# EAGLE design sensebox (EAGLE 6.1)
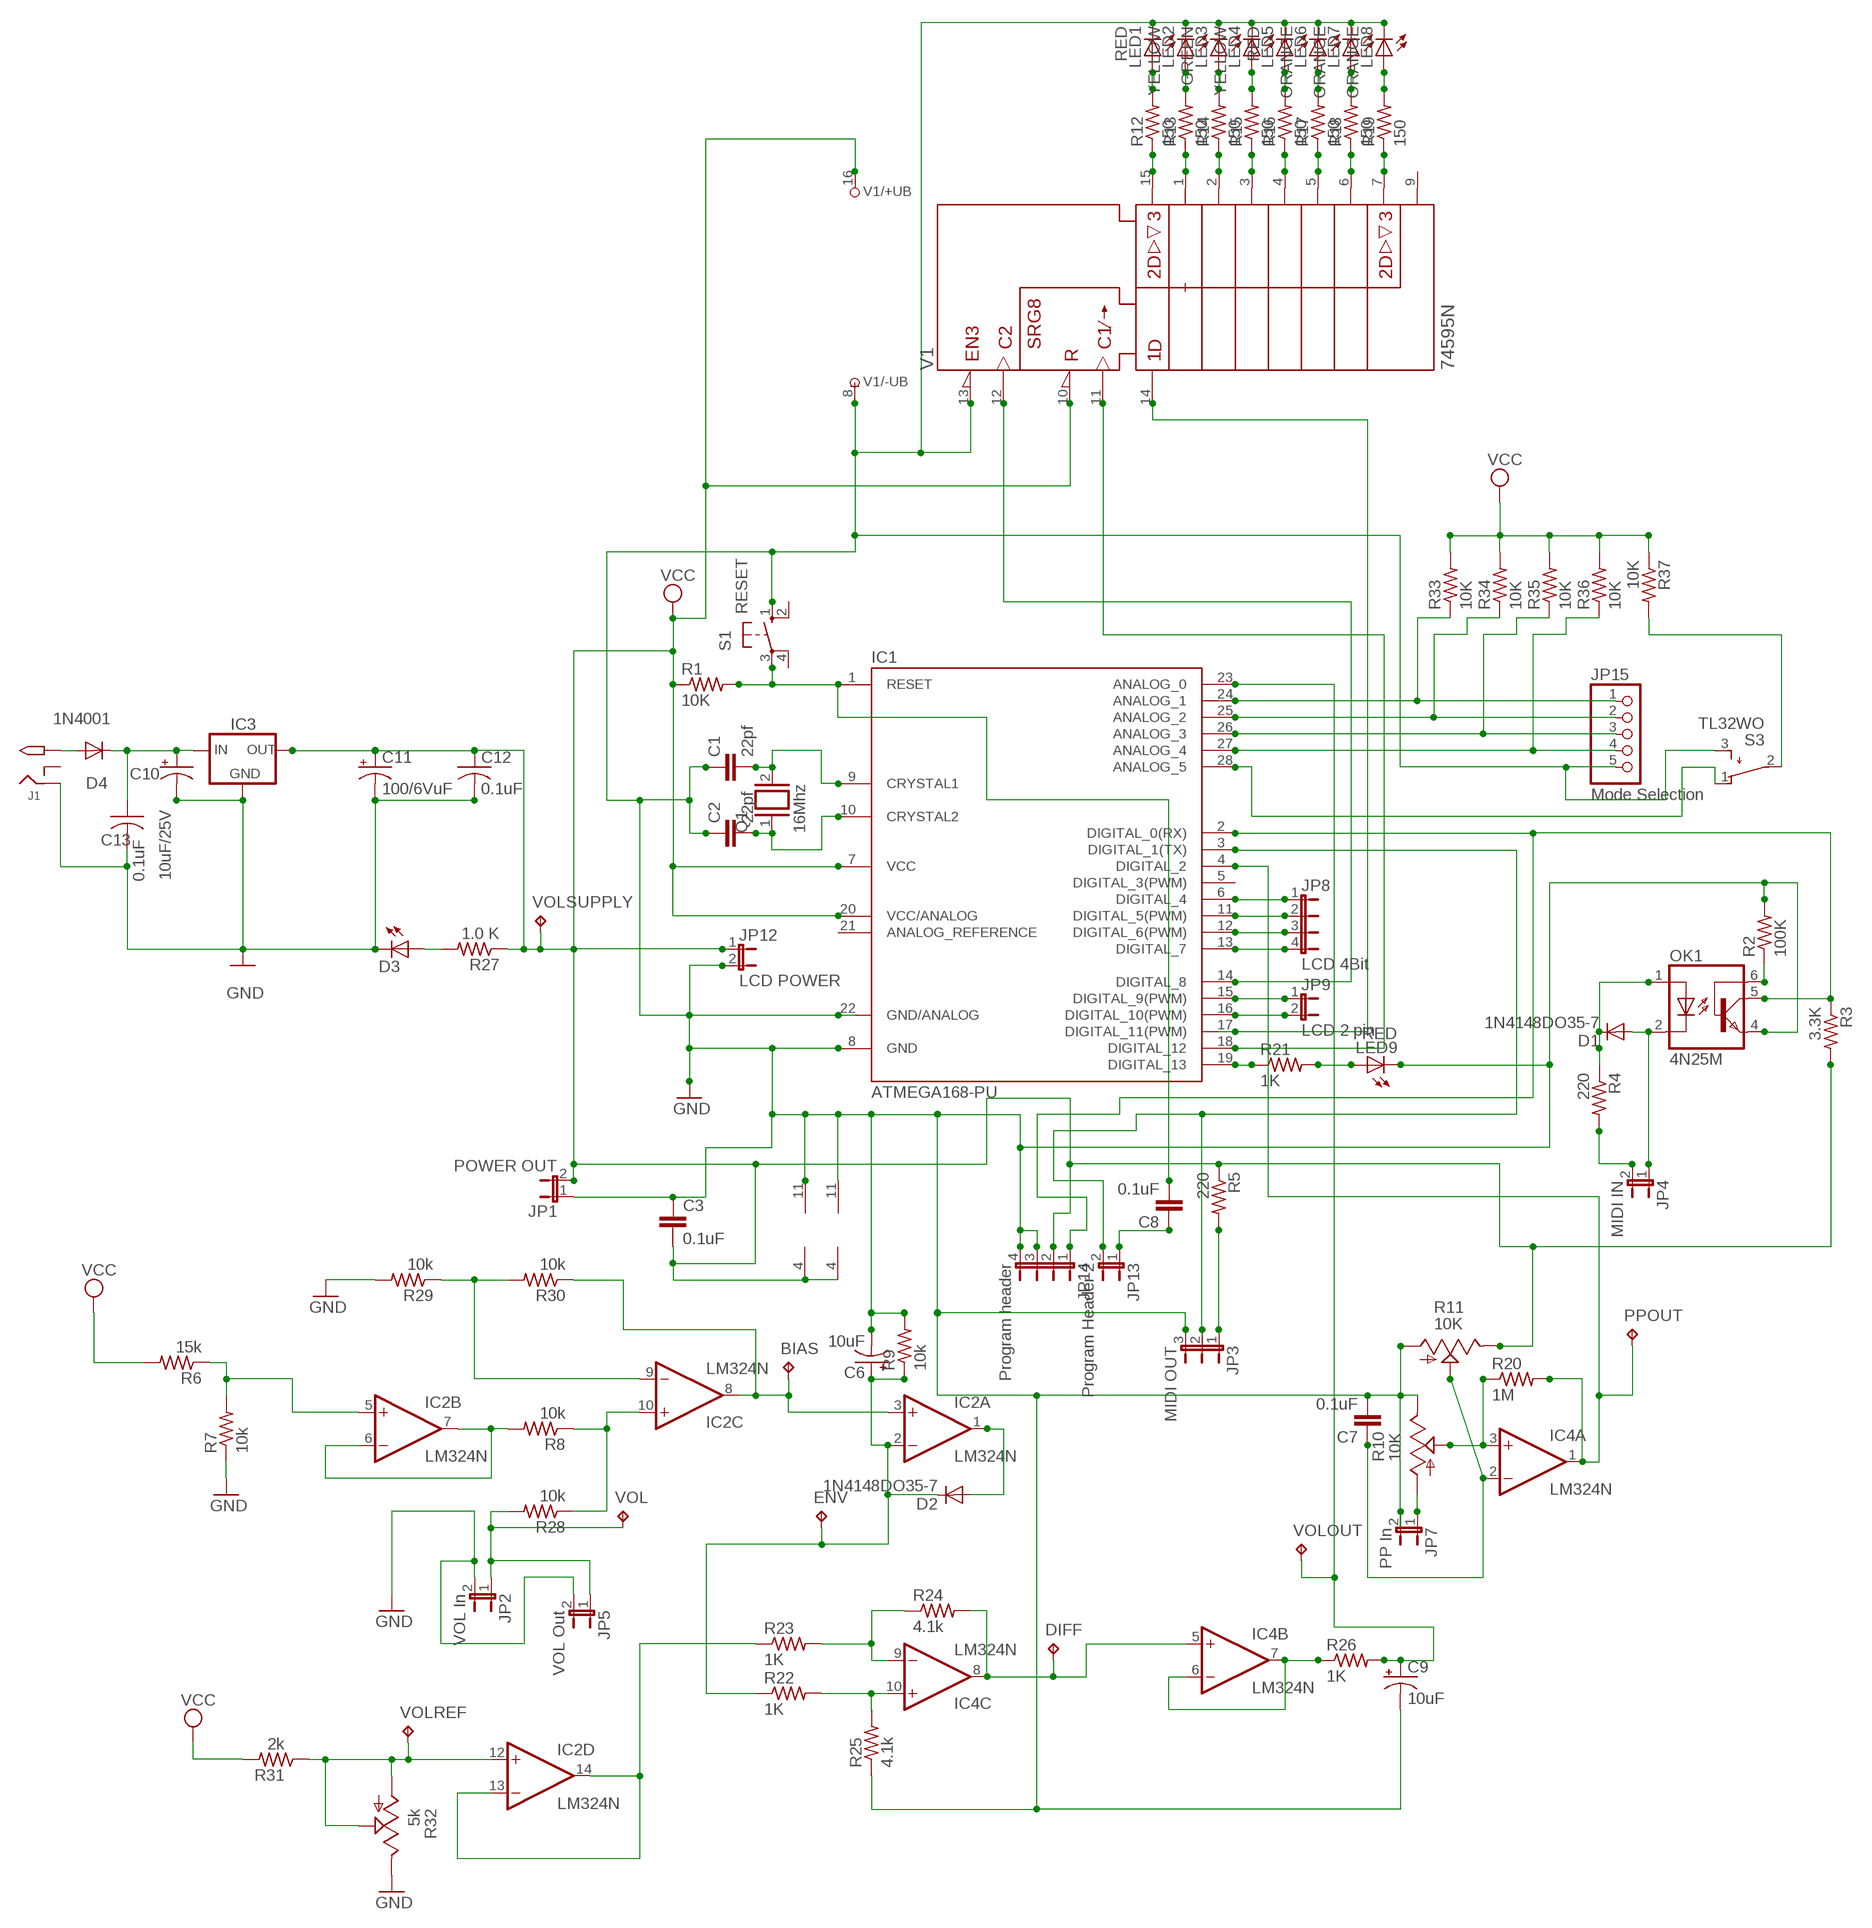
[diagram p0: schematic, sheet 1]

## Parts
BIAS  TP1X1  [TP1X1]
C1  22pf  C2.5/2  [C2.5-2]
C2  22pf  C2.5/2  [C2.5-2]
C3  0.1uF  C5/2.5  [C5B2.5]
C6  10uF  CPOL-USE5-8.5  [E5-8,5]
C7  0.1uF  C5/2.5  [C5B2.5]
C8  0.1uF  C2.5/2  [C2.5-2]
C9  10uF  CPOL-USE5-8.5  [E5-8,5]
C10  10uF/25V  CPOL-USE2.5-6  [E2,5-6]
C11  100/6VuF  CPOL-USE2.5-6  [E2,5-6]
C12  0.1uF  C-US025-025X050  [C025-025X050]
C13  0.1uF  C-US025-025X050  [C025-025X050]
D1  1N4148DO35-7  [DO35-7]
D2  1N4148DO35-7  [DO35-7]
D3  GREEN  LED3MM  [LED3MM]
D4  1N4001  1N4004  [DO41-10]
DIFF  TP1X1  [TP1X1]
ENV  TP1X1  [TP1X1]
IC1  ATMEGA168-PU  [DIL28-3]
IC2  LM324N  [DIL14]
IC3  +5v 7805  78XXS  [78XXS]
IC4  LM324N  [DIL14]
J1  2.1MMJACK  [PJ-102A]
JP1  POWER OUT  JP1E  [JP1]
JP2  VOL In  JP1E  [JP1]
JP3  MIDI OUT  JP2E  [JP2]
JP4  MIDI IN  JP1E  [JP1]
JP5  VOL Out  JP1E  [JP1]
JP7  PP In  JP1E  [JP1]
JP8  LCD 4Bit  JP4E  [JP4]
JP9  LCD 2 pin  JP1E  [JP1]
JP12  LCD POWER  JP1E  [JP1]
JP13  Program Header 2  JP1E  [JP1]
JP14  Program header  JP4E  [JP4]
JP15  Mode Selection  PINHD-1X5  [1X05]
LED1  RED  LED5MM  [LED5MM]
LED2  YELLOW  LED5MM  [LED5MM]
LED3  GREEN  LED5MM  [LED5MM]
LED4  YELLOW  LED5MM  [LED5MM]
LED5  RED  LED5MM  [LED5MM]
LED6  ORANGE  LED5MM  [LED5MM]
LED7  ORANGE  LED5MM  [LED5MM]
LED8  ORANGE  LED5MM  [LED5MM]
LED9  RED  LED5MM  [LED5MM]
OK1  4N25M  [DIL06]
PPOUT  TP1X1  [TP1X1]
Q1  16Mhz  XTAL  [Q]
R1  10K  R-US_0207/7  [0207/7]
R2  100K  R-US_0207/7  [0207/7]
R3  3.3K  R-US_0207/7  [0207/7]
R4  220  R-US_0207/7  [0207/7]
R5  220  R-US_0207/7  [0207/7]
R6  15k  R-US_0207/10  [0207/10]
R7  10k  R-US_0207/10  [0207/10]
R8  10k  R-US_0207/10  [0207/10]
R9  10k  R-US_0207/7  [0207/7]
R10  10K  TRIM_US-B64Y  [B64Y]
R11  10K  TRIM_US-B64Y  [B64Y]
R12  150  R-US_0207/7  [0207/7]
R13  150  R-US_0207/7  [0207/7]
R14  150  R-US_0207/7  [0207/7]
R15  150  R-US_0207/7  [0207/7]
R16  150  R-US_0207/7  [0207/7]
R17  150  R-US_0207/7  [0207/7]
R18  150  R-US_0207/7  [0207/7]
R19  150  R-US_0207/7  [0207/7]
R20  1M  R-US_0207/7  [0207/7]
R21  1K  R-US_0207/7  [0207/7]
R22  1K  R-US_0207/7  [0207/7]
R23  1K  R-US_0207/7  [0207/7]
R24  4.1k  R-US_0207/7  [0207/7]
R25  4.1k  R-US_0207/7  [0207/7]
R26  1K  R-US_0207/7  [0207/7]
R27  1.0 K  R-US_0207/5V  [0207/5V]
R28  10k  R-US_0207/10  [0207/10]
R29  10k  R-US_0207/10  [0207/10]
R30  10k  R-US_0207/10  [0207/10]
R31  2k  R-US_0207/10  [0207/10]
R32  5k  TRIM_US-B64Y  [B64Y]
R33  10K  R-US_0207/7  [0207/7]
R34  10K  R-US_0207/7  [0207/7]
R35  10K  R-US_0207/7  [0207/7]
R36  10K  R-US_0207/7  [0207/7]
R37  10K  R-US_0207/7  [0207/7]
S1  RESET  10-XX  [B3F-10XX]
S3  TL32WO  [TL3XWO]
V1  74595N  [DIL16]
VOL  TP1X1  [TP1X1]
VOLOUT  TP1X1  [TP1X1]
VOLREF  TP1X1  [TP1X1]
VOLSUPPLY  TP1X1  [TP1X1]

## Nets
GND: C1.1 C2.1 C3.1 C6.- C7.2 C9.- C10.- C11.- C12.2 C13.2 D3.K(C) IC1.8(GND) IC1.22(GND/ANALOG) IC2.11(P:V-) IC3.GND IC4.11(P:V-) J1.RING JP1.1 JP2.2 JP3.3 JP5.2 JP7.2 JP12.2 JP14.3 JP14.4 JP15.5 LED1.K(C) LED2.K(C) LED3.K(C) LED4.K(C) LED5.K(C) LED6.K(C) LED7.K(C) LED8.K(C) LED9.K(C) OK1.4(EMI) R2.2 R7.1 R9.2 R10.E R11.A R25.1 R29.2 R32.E S1.1(S) S3.3(S) V1.8(-UB) V1.13(!G)
N$1: C8.2 IC1.1(RESET) R1.2 S1.3(P)
N$2: C1.2 IC1.9(CRYSTAL1) Q1.2
N$3: C2.2 IC1.10(CRYSTAL2) Q1.1
N$4: JP3.1 R5.2
N$5: IC1.3(DIGITAL_1(TX)) JP3.2 JP13.2
N$6: D1.A JP4.1 OK1.2(C)
N$7: D4.A J1.TIP
N$8: OK1.6(BAS) R2.1
N$9: IC2.5(B:+IN) R6.1 R7.2
N$10: IC1.2(DIGITAL_0(RX)) JP14.1 OK1.5(COL) R3.1
N$11: JP2.1 JP5.1 R28.2 VOL.P$1(TP)
N$12: JP7.1 R10.A
N$13: JP4.2 R4.2
N$14: D2.A IC2.1(A:OUT)
N$15: C6.+ D2.C ENV.P$1(TP) IC2.2(A:-IN) R9.1 R22.1
N$16: IC2.10(C:+IN) R8.1 R28.1
N$17: IC4.3(A:+IN) R10.S R20.1
N$18: C7.1 IC4.2(A:-IN) R11.S
N$19: R12.1 V1.15(QA)
N$20: IC1.4(DIGITAL_2) IC4.1(A:OUT) PPOUT.P$1(TP) R20.2
N$21: IC1.17(DIGITAL_11(PWM)) V1.14(SER)
N$22: IC1.18(DIGITAL_12) V1.11(SRCK)
N$23: IC1.14(DIGITAL_8) V1.12(RCK)
N$24: R13.1 V1.1(QB)
N$25: R14.1 V1.2(QC)
N$26: R15.1 V1.3(QD)
N$27: R16.1 V1.4(QE)
N$28: R17.1 V1.5(QF)
N$29: R18.1 V1.6(QG)
N$30: R19.1 V1.7(QH)
N$31: LED1.A R12.2
N$32: LED2.A R13.2
N$33: LED3.A R14.2
N$34: LED4.A R15.2
N$35: LED5.A R16.2
N$36: LED6.A R17.2
N$37: LED7.A R18.2
N$38: LED8.A R19.2
N$39: IC1.24(ANALOG_1) JP15.1 R33.1
N$40: IC1.6(DIGITAL_4) JP8.1
N$41: IC1.11(DIGITAL_5(PWM)) JP8.2
N$42: IC1.12(DIGITAL_6(PWM)) JP8.3
N$43: IC1.13(DIGITAL_7) JP8.4
N$44: IC1.15(DIGITAL_9(PWM)) JP9.1
N$45: IC1.16(DIGITAL_10(PWM)) JP9.2
N$46: IC1.28(ANALOG_5) S3.1(O)
N$47: IC1.25(ANALOG_2) JP15.2 R34.1
N$48: C8.1 JP13.1
N$49: IC1.19(DIGITAL_13) R21.1
N$50: LED9.A R21.2
N$51: IC4.6(B:-IN) IC4.7(B:OUT) R26.1
N$52: IC4.9(C:-IN) R23.2 R24.1
N$53: IC4.10(C:+IN) R22.2 R25.2
N$54: DIFF.P$1(TP) IC4.5(B:+IN) IC4.8(C:OUT) R24.2
N$55: D1.C OK1.1(A) R4.1
N$56: C9.+ IC1.23(ANALOG_0) R26.2 VOLOUT.P$1(TP)
N$57: C10.+ C13.1 D4.C IC3.IN
N$58: D3.A R27.2
N$59: IC2.6(B:-IN) IC2.7(B:OUT) R8.2
N$60: IC1.26(ANALOG_3) JP15.3 R35.1
N$61: IC1.27(ANALOG_4) JP15.4 R36.1
N$62: R37.2 S3.2(P)
N$63: IC2.13(D:-IN) IC2.14(D:OUT) R23.1
N$66: IC2.9(C:-IN) R29.1 R30.2
N$68: BIAS.P$1(TP) IC2.3(A:+IN) IC2.8(C:OUT) R30.1
N$71: IC2.12(D:+IN) R31.1 R32.A R32.S VOLREF.P$1(TP)
VCC: C3.2 C11.+ C12.1 IC1.7(VCC) IC1.20(VCC/ANALOG) IC2.4(P:V+) IC3.OUT IC4.4(P:V+) JP1.2 JP12.1 JP14.2 R1.1 R3.2 R5.1 R6.2 R11.E R27.1 R31.2 R33.2 R34.2 R35.2 R36.2 R37.1 V1.10(!SRCLR) V1.16(+UB) VOLSUPPLY.P$1(TP)
Unconnected: IC1.5(DIGITAL_3(PWM)) IC1.21(ANALOG_REFERENCE) IC4.12(D:+IN) IC4.13(D:-IN) IC4.14(D:OUT) J1.RING_SW S1.2(S1) S1.4(P1) V1.9(QH*)

## Library data of the parts
BIAS DIFF ENV PPOUT VOL VOLOUT VOLREF VOLSUPPLY = testpad (2):TP1X1
C1-C3 C7 C8 = capacitor-wima:C: CAPACITOR naming: grid - package width
C6 C9 = rcl:CPOL-US: POLARIZED CAPACITOR, American symbol
C10 C11 = minimidi:CPOL-US: POLARIZED CAPACITOR, American symbol
C12 C13 = minimidi:C-US: CAPACITOR, American symbol
D1 D2 = diode:1N4148: DIODE high speed (Philips)
D3 = minimidi:LED: LED
D4 = minimidi:1N4004: DIODE general purpose rectifier, 1 A
IC1 = Arduino-AVR:ATMEGA168-PU
IC2 IC4 = linear:LM324: OP AMP
IC3 = v-reg:78XXS: VOLTAGE REGULATOR
J1 = minimidi:2.1MMJACK
JP1 JP2 JP4 JP5 JP7 JP9 JP12 JP13 = jumper:JP1E: JUMPER
JP3 = jumper:JP2E: JUMPER
JP8 JP14 = jumper:JP4E: JUMPER
JP15 = pinhead:PINHD-1X5: PIN HEADER
LED1-LED9 = led:LED: LED
OK1 = optocoupler:4N*?M: General Purpose 6-Pin Phototransistor Optocouplers Source: http://www.fairchildsemi.com/ds/4N/4N35-M.pdf
Q1 = special:XTAL: CRYSTAL
R1-R5 R9 R12-R26 R28 R30 R33-R37 = resistor:R-US_: RESISTOR, American symbol
R6-R8 R29 R31 = rcl:R-US_: RESISTOR, American symbol
R10 R11 R32 = pot:TRIM_US-: POTENTIOMETER
R27 = minimidi:R-US_: RESISTOR, American symbol
S1 = switch-omron:10-XX: OMRON SWITCH
S3 = switch:TL32WO: TINY SWITCH ON - MOM Source: http://www2.produktinfo.conrad.com/datenblaetter/700000-724999/705152-da-01-de-Subminiaturschalter_TL_36WO.pdf
V1 = 74ttl-din:74*595: 8-bit SHIFT REGISTER, output latch

## Board
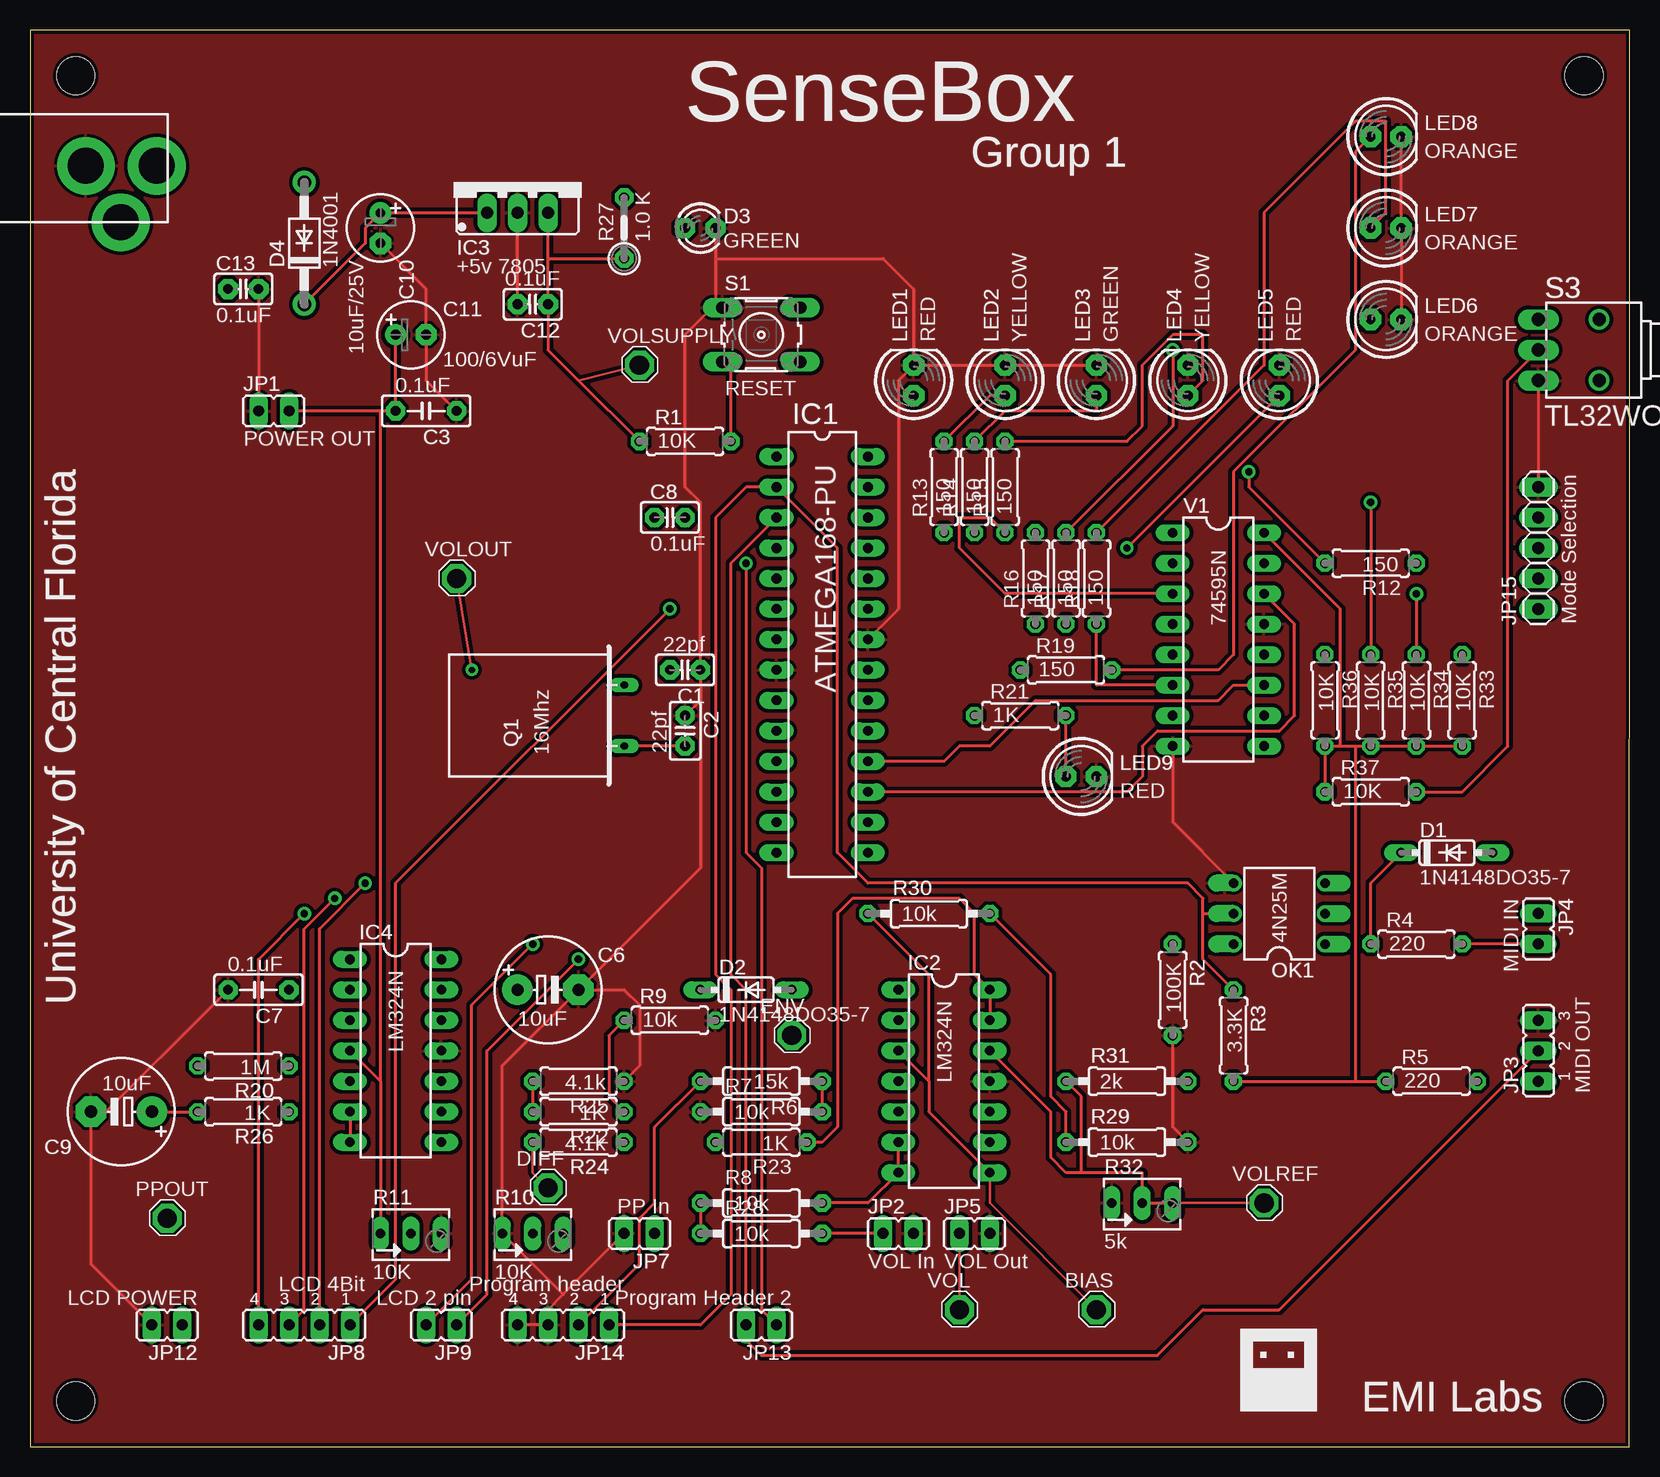
[diagram p1: board, top side]
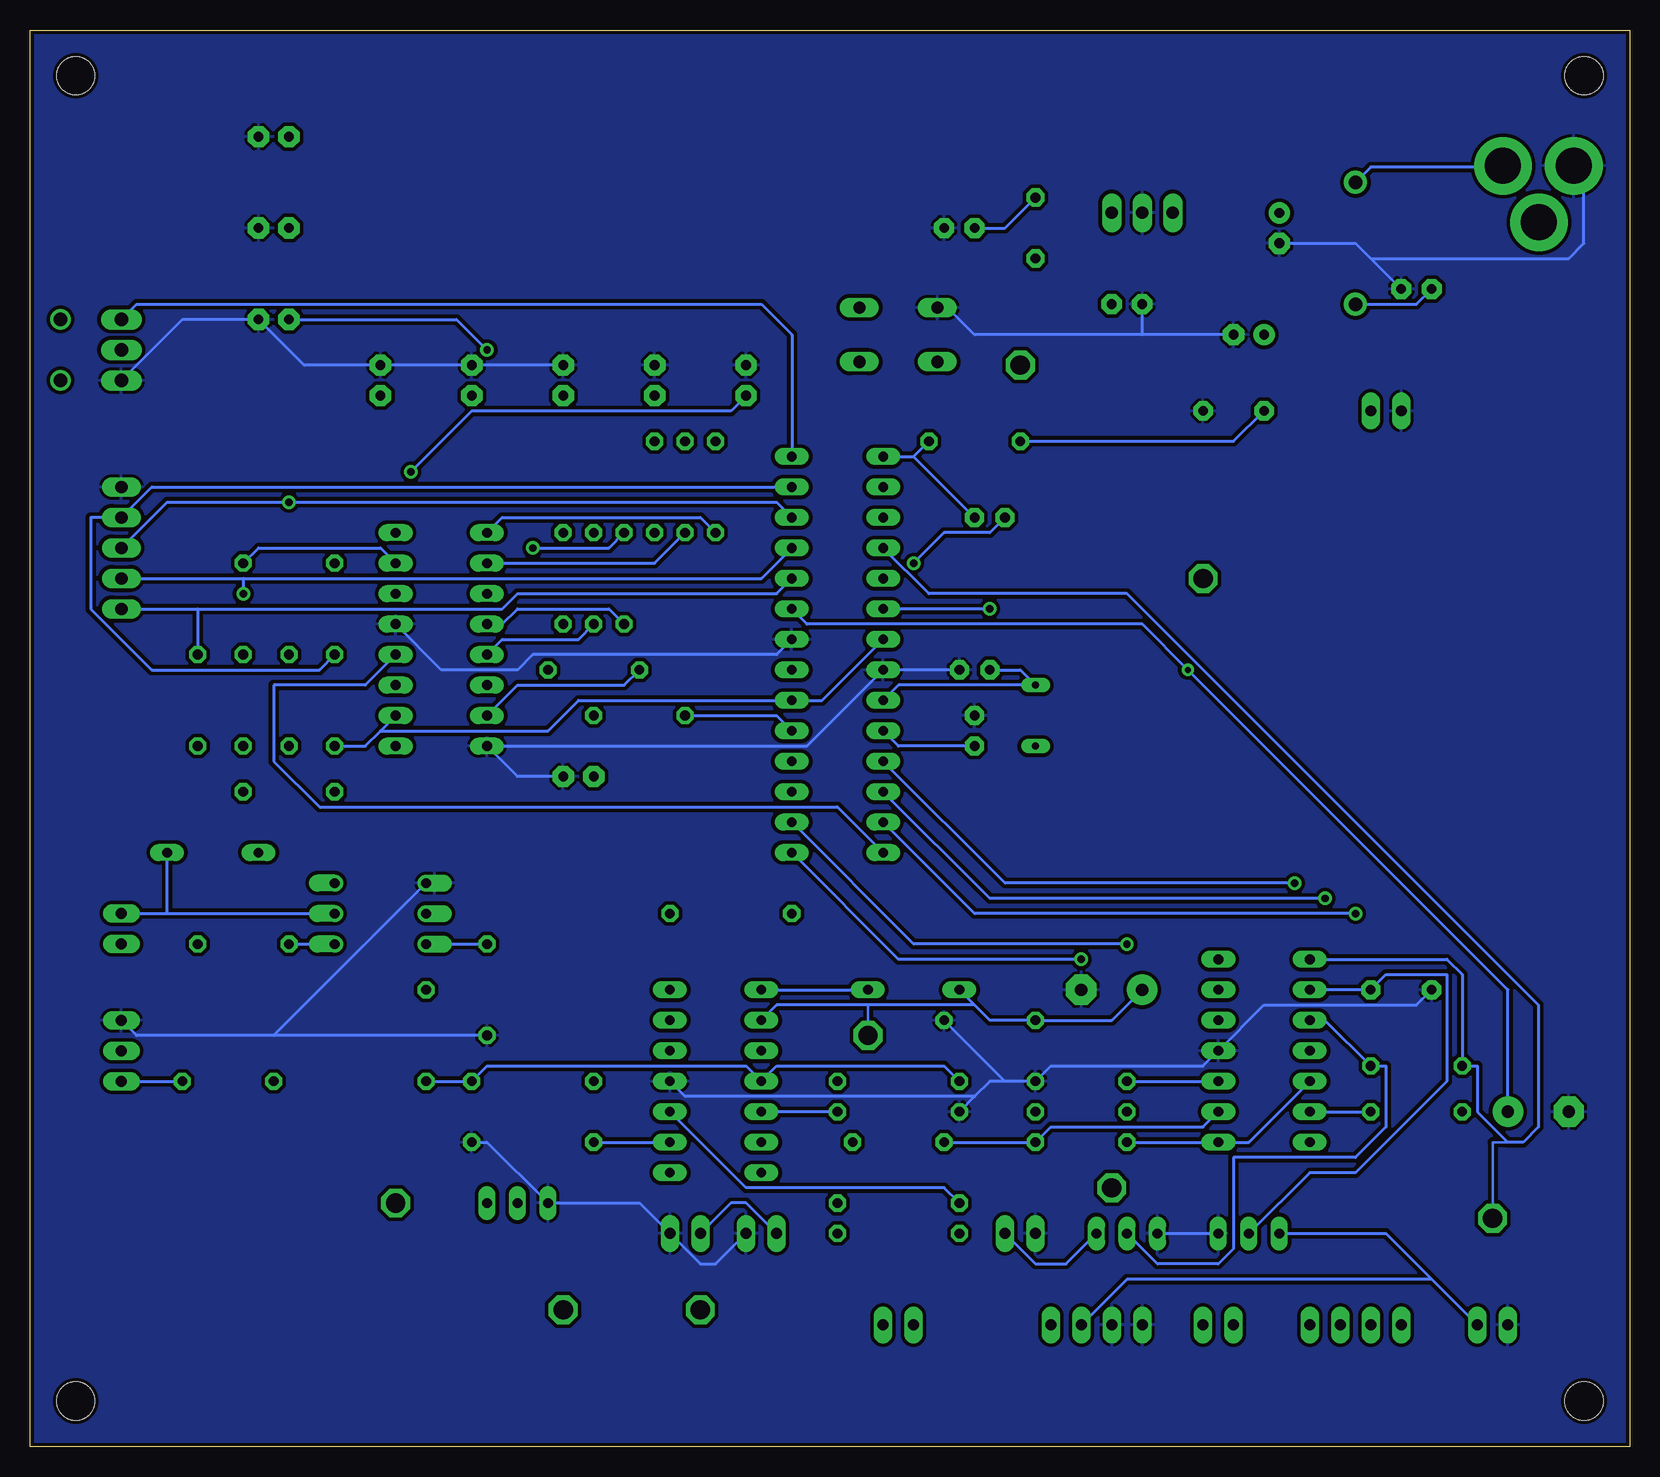
[diagram p2: board, bottom side, seen from below]

Size 133.35 x 118.11 mm. Coordinates in mm from the lower left corner, seen from the top.
Outline: 0,0 133.33,0 133.35,118.11 0,118.11 0,0
Copper layers (1*16): Top 0.035mm / dielectric 1.5mm / Bottom 0.035mm
Design rules: minimum track width 8mil, minimum drill 20mil, track to track 8mil, track to pad 8mil, pad to pad 8mil, via to via 8mil, smd to smd 8mil, copper to edge 10mil, drill to drill 8mil, minimum pad ring 12mil, minimum via ring 10mil, stop-mask expansion 4mil, vias tented up to drill 25mil, thermal gap 10mil
Holes 3.17 mm at 3.81,114.3 129.54,114.3 129.54,3.81 3.81,3.81

### Footprints (pad centres in the part's own frame; a part is rotated, then mirrored left to right if it is on the bottom)
TP1X1 = drill 1.6 octagon: P$1 0,0
C2.5-2 = drill 0.813 pad 1.6 octagon: 1 -1.27,0; 2 1.27,0
C5B2.5 = drill 0.813 pad 1.6 octagon: 1 -2.54,0; 2 2.54,0
E5-8,5 = drill 1.016 pad 2.54: + -2.54,0 | drill 1.016 pad 2.54 octagon: - 2.54,0
E2,5-6 = drill 0.813 pad 1.778: + -1.27,0 | drill 0.813 pad 1.778 octagon: - 1.27,0
C025-025X050 = drill 0.813 pad 1.676 octagon: 1 -1.27,0; 2 1.27,0
DO35-7 = drill 0.813 long: A 3.81,0; C -3.81,0
LED3MM = drill 0.813 pad 1.676 octagon: A -1.27,0; K 1.27,0
DO41-10 = drill 1.118 pad 1.93: A 5.08,0; C -5.08,0
DIL28-3 = drill 0.813 long: 1 -16.51,-3.81; 2 -13.97,-3.81; 3 -11.43,-3.81; 4 -8.89,-3.81; 5 -6.35,-3.81; 6 -3.81,-3.81; 7 -1.27,-3.81; 8 1.27,-3.81; 9 3.81,-3.81; 10 6.35,-3.81; 11 8.89,-3.81; 12 11.43,-3.81; 13 13.97,-3.81; 14 16.51,-3.81; 15 16.51,3.81; 16 13.97,3.81; 17 11.43,3.81; 18 8.89,3.81; 19 6.35,3.81; 20 3.81,3.81; 21 1.27,3.81; 22 -1.27,3.81; 23 -3.81,3.81; 24 -6.35,3.81; 25 -8.89,3.81; 26 -11.43,3.81; 27 -13.97,3.81; 28 -16.51,3.81
DIL14 = drill 0.813 long: 1 -7.62,-3.81; 2 -5.08,-3.81; 3 -2.54,-3.81; 4 0,-3.81; 5 2.54,-3.81; 6 5.08,-3.81; 7 7.62,-3.81; 8 7.62,3.81; 9 5.08,3.81; 10 2.54,3.81; 11 0,3.81; 12 -2.54,3.81; 13 -5.08,3.81; 14 -7.62,3.81
78XXS = drill 1.016 long: GND 0,-2.54; IN -2.54,-2.54; OUT 2.54,-2.54
PJ-102A = drill 3 pad 4.8: RING 0.1,-3.39; RING_SW -4.6,-6.29; TIP 0.1,-9.29
JP1 = drill 0.914 long: 1 0,-1.27; 2 0,1.27
JP2 = drill 0.914 long: 1 -2.54,0; 2 0,0; 3 2.54,0
JP4 = drill 0.914 long: 1 -3.81,0; 2 -1.27,0; 3 1.27,0; 4 3.81,0
1X05 = drill 1.016 long: 1 -5.08,0; 2 -2.54,0; 3 0,0; 4 2.54,0; 5 5.08,0
LED5MM = drill 0.813 pad 1.778 octagon: A -1.27,0; K 1.27,0
DIL06 = drill 0.813 offset: 1 -2.54,-3.81; 2 0,-3.81; 3 2.54,-3.81; 4 2.54,3.81; 5 0,3.81; 6 -2.54,3.81
Q = drill 0.61 long: 1 -2.54,-7.62; 2 2.54,-7.62
0207/7 = drill 0.813 octagon: 1 -3.81,0; 2 3.81,0
0207/10 = drill 0.813 octagon: 1 -5.08,0; 2 5.08,0
B64Y = drill 0.813 long: A 2.54,0; E -2.54,0; S 0,0
0207/5V = drill 0.813 pad 1.524 octagon: 1 -2.54,0; 2 2.54,0
B3F-10XX = drill 1.016 long: 1 -3.251,2.261; 2 3.251,2.261; 3 -3.251,-2.261; 4 3.251,-2.261
TL3XWO = drill 1.1 pad 1.422 long: 1 -2.54,-5.08; 2 0,-5.08; 3 2.54,-5.08 | drill 1.1 pad 1.676: M1 -2.54,0; M2 2.54,0
DIL16 = drill 0.813 long: 1 -8.89,-3.81; 2 -6.35,-3.81; 3 -3.81,-3.81; 4 -1.27,-3.81; 5 1.27,-3.81; 6 3.81,-3.81; 7 6.35,-3.81; 8 8.89,-3.81; 9 8.89,3.81; 10 6.35,3.81; 11 3.81,3.81; 12 1.27,3.81; 13 -1.27,3.81; 14 -3.81,3.81; 15 -6.35,3.81; 16 -8.89,3.81

### Placement (x,y rotation side)
BIAS  88.9,11.43 0 top
C1  54.61,64.77 180 top
C2  54.61,59.69 270 top
C3  33.02,86.36 180 top
C6  43.18,38.1 0 top
C7  19.05,38.1 180 top
C8  53.34,77.47 0 top
C9  7.62,27.94 180 top
C10  29.21,101.6 270 top
C11  31.75,92.71 0 top
C12  41.91,95.25 180 top
C13  17.78,96.52 0 top
D1  118.11,49.53 0 top
D2  59.69,38.1 0 top
D3  55.88,101.6 0 top
D4  22.86,100.33 90 top
DIFF  43.18,21.59 0 top
ENV  63.5,34.29 0 top
IC1  66.04,66.04 270 top
IC2  76.2,30.48 270 top
IC3  40.64,105.41 0 top
IC4  30.48,33.02 270 top
J1  1.27,106.68 90 top
JP1  20.32,86.36 270 top
JP2  72.39,17.78 270 top
JP3  125.73,33.02 90 top
JP4  125.73,43.18 180 top
JP5  78.74,17.78 270 top
JP7  50.8,17.78 90 top
JP8  22.86,10.16 180 top
JP9  34.29,10.16 90 top
JP12  11.43,10.16 90 top
JP13  60.96,10.16 90 top
JP14  44.45,10.16 180 top
JP15  125.73,74.93 90 top
LED1  73.66,88.9 90 top
LED2  81.28,88.9 90 top
LED3  88.9,88.9 90 top
LED4  96.52,88.9 90 top
LED5  104.14,88.9 90 top
LED6  113.03,93.98 0 top
LED7  113.03,101.6 0 top
LED8  113.03,109.22 0 top
LED9  87.63,55.88 0 top
OK1  104.14,44.45 90 top
PPOUT  11.43,19.05 0 top
Q1  41.91,60.96 90 top
R1  54.61,83.82 0 top
R2  95.25,38.1 270 top
R3  100.33,34.29 270 top
R4  115.57,41.91 0 top
R5  116.84,30.48 0 top
R6  60.96,30.48 180 top
R7  60.96,27.94 0 top
R8  60.96,20.32 0 top
R9  53.34,35.56 0 top
R10  41.91,17.78 0 top
R11  31.75,17.78 0 top
R12  111.76,73.66 180 top
R13  76.2,80.01 90 top
R14  78.74,80.01 90 top
R15  81.28,80.01 90 top
R16  83.82,72.39 90 top
R17  86.36,72.39 90 top
R18  88.9,72.39 90 top
R19  86.36,64.77 0 top
R20  17.78,31.75 180 top
R21  82.55,60.96 0 top
R22  45.72,27.94 180 top
R23  60.96,25.4 180 top
R24  45.72,25.4 180 top
R25  45.72,30.48 180 top
R26  17.78,27.94 180 top
R27  49.53,101.6 90 top
R28  60.96,17.78 0 top
R29  91.44,25.4 0 top
R30  74.93,44.45 0 top
R31  91.44,30.48 0 top
R32  92.71,20.32 0 top
R33  119.38,62.23 270 top
R34  115.57,62.23 270 top
R35  111.76,62.23 270 top
R36  107.95,62.23 270 top
R37  111.76,54.61 0 top
S1  60.96,92.71 0 top
S3  130.81,91.44 270 top
V1  99.06,67.31 270 top
VOL  77.47,11.43 0 top
VOLOUT  35.56,72.39 0 top
VOLREF  102.87,20.32 0 top
VOLSUPPLY  50.8,90.17 0 top

### Tracks (layer width: path | path; a pad name or v marks a point on that pad's centre or on a via)
GND
  Top 0.254: C13.2 JP1.1 | C12.2 IC3.GND | D3.K 57.15,99.06 | 57.15,99.06 57.15,95.25 | C3.1 33.02,88.9 C11.- 33.02,96.52 C10.- | S3.3 JP15.5 | LED6.K LED7.K LED8.K | IC1.22 72.39,69.85 72.39,88.9 LED1.K | LED1.K LED2.K LED3.K | JP14.4 JP14.3 43.18,11.43 44.45,12.7 | 44.45,12.7 JP7.2 | 44.45,12.7 R10.E 39.37,31.75 C6.- | JP12.2 5.08,15.24 5.08,26.67 | C9.- 5.08,26.67 | 5.08,26.67 C7.2 | R25.1 50.8,31.75 50.8,36.83 49.53,38.1 C6.- | 55.88,62.23 C2.1 | 55.88,62.23 C1.1 55.88,78.74 54.61,80.01 54.61,92.71 57.15,95.25 | OK1.4 95.25,52.07 V1.8 | R2.2 95.25,26.67 R29.2 | C6.- 55.88,48.26 55.88,62.23 | 57.15,95.25 S1.1 | 57.15,99.06 71.12,99.06 73.66,96.52 LED1.K
  Bottom 0.254: C11.- 40.64,92.71 | 40.64,92.71 54.61,92.71 57.15,95.25 S1.1 | 40.64,92.71 C12.2 | 21.59,99.06 22.86,100.33 C10.- | 21.59,99.06 C13.2 | J1.RING 3.81,106.68 3.81,100.33 5.08,99.06 21.59,99.06 | S3.3 120.65,93.98 LED6.K 110.49,90.17 LED5.K LED4.K LED3.K | V1.13 99.06,64.77 92.71,64.77 91.44,66.04 71.12,66.04 IC1.22 | R10.E R11.A | 54.61,29.21 53.34,30.48 52.07,30.48 | 54.61,29.21 R7.1 | 52.07,30.48 R25.1 48.26,31.75 35.56,31.75 IC4.11 30.48,36.83 17.78,36.83 C7.2 | 52.07,30.48 R9.2 | IC2.11 78.74,29.21 54.61,29.21 | C1.1 IC1.8 68.58,58.42 V1.8 92.71,55.88 LED9.K | JP2.2 76.2,15.24 77.47,15.24 JP5.2 82.55,20.32 R32.E 95.25,25.4 R29.2 | JP3.3 124.46,34.29 113.03,34.29 | R2.2 113.03,34.29 | 113.03,34.29 OK1.4
  pour Top (isolate 0.305): 0,118.11 133.35,118.11 133.35,0 0,0
  pour Bottom (isolate 0.305): 0,118.11 133.35,118.11 133.35,0 0,0
N$1
  Top 0.254: R1.2 58.42,90.17 S1.3
  Bottom 0.254: 59.69,82.55 R1.2 | IC1.1 59.69,82.55 | 59.69,82.55 C8.2
N$2
  Bottom 0.254: C1.2 50.8,64.77 Q1.2 60.96,63.5 IC1.9
N$3
  Top 0.254: C2.2 Q1.1
  Bottom 0.254: IC1.10 60.96,58.42 C2.2
N$4
  Bottom 0.254: JP3.1 R5.2
N$5
  Top 0.254: IC1.3 58.42,73.66 58.42,39.37 59.69,38.1 JP13.2 59.69,8.89 60.96,7.62 93.98,7.62 97.79,11.43 104.14,11.43 JP3.2
N$6
  Bottom 0.254: JP4.1 121.92,44.45 | 121.92,44.45 OK1.2 | 121.92,44.45 D1.A
N$7
  Bottom 0.254: D4.A 21.59,106.68 11.43,106.68 J1.TIP
N$8
  Bottom 0.254: OK1.6 R2.1
N$9
  Top 0.254: R6.1 R7.2
  Bottom 0.254: R7.2 IC2.5
N$10
  Top 0.254: 97.79,44.45 97.79,40.64 R3.1 | 97.79,44.45 OK1.5 | JP14.1 55.88,10.16 58.42,12.7 58.42,38.1 57.15,39.37 57.15,77.47 59.69,80.01 IC1.2 67.31,74.93 67.31,49.53 69.85,46.99 96.52,46.99 97.79,45.72 97.79,44.45
N$11
  Top 0.203: JP5.1 VOL.P$1
  Top 0.254: JP2.1 R28.2
  Bottom 0.254: JP5.1 74.93,20.32 73.66,20.32 JP2.1
N$12
  Bottom 0.254: R10.A 46.99,15.24 49.53,15.24 JP7.1
N$13
  Top 0.254: JP4.2 R4.2
N$14
  Bottom 0.254: IC2.1 D2.A
N$15
  Top 0.254: R22.1 48.26,29.21 48.26,34.29 R9.1
  Bottom 0.203: 63.5,36.83 ENV.P$1
  Bottom 0.254: 54.61,36.83 53.34,35.56 R9.1 43.18,35.56 C6.+ | 54.61,36.83 D2.C | IC2.2 71.12,36.83 63.5,36.83 54.61,36.83
N$16
  Top 0.254: R8.1 R28.1
  Bottom 0.254: IC2.10 73.66,21.59 57.15,21.59 R8.1
N$17
  Bottom 0.254: IC4.3 25.4,35.56 R20.1 20.32,31.75 20.32,26.67 22.86,24.13 33.02,24.13 33.02,16.51 34.29,15.24 39.37,15.24 R10.S
N$18
  Bottom 0.254: IC4.2 C7.1 20.32,39.37 15.24,39.37 15.24,30.48 22.86,22.86 26.67,22.86 R11.S
N$19
  Bottom 0.254: V1.15 104.14,74.93 114.3,74.93 R12.1
N$20
  Bottom 0.203: PPOUT.P$1 11.43,25.4 10.16,25.4
  Bottom 0.254: IC1.4 58.42,71.12 41.91,71.12 7.62,36.83 7.62,26.67 8.89,25.4 10.16,25.4 12.7,27.94 12.7,31.75 R20.2 13.97,39.37 15.24,40.64 IC4.1
N$21
  Top 0.254: V1.14 105.41,68.58 105.41,60.96 104.14,59.69 93.98,59.69 92.71,58.42 92.71,55.88 91.44,54.61 IC1.17
N$22
  Top 0.254: V1.11 100.33,63.5 99.06,62.23 83.82,62.23 80.01,58.42 77.47,58.42 76.2,57.15 IC1.18
N$23
  Bottom 0.254: IC1.14 66.04,53.34 109.22,53.34 113.03,57.15 113.03,63.5 105.41,63.5 V1.12
N$24
  Bottom 0.254: R13.1 77.47,77.47 93.98,77.47 V1.1
N$25
  Bottom 0.254: R14.1 81.28,73.66 V1.2
N$26
  Top 0.254: R15.1 80.01,77.47 77.47,77.47 77.47,74.93 81.28,71.12 V1.3
N$27
  Bottom 0.254: R16.1 85.09,69.85 92.71,69.85 93.98,68.58 V1.4
N$28
  Bottom 0.254: R17.1 87.63,67.31 93.98,67.31 V1.5
N$29
  Top 0.254: R18.1 88.9,63.5 V1.6
N$30
  Bottom 0.254: R19.1 83.82,63.5 92.71,63.5 V1.7
N$31  (via drill 0.61)
  Top 0.254: R12.2 101.6,80.01 v101.6,81.28
  Bottom 0.254: v101.6,81.28 96.52,86.36 74.93,86.36 LED1.A
N$32
  Top 0.254: R13.2 80.01,87.63 LED2.A
N$33
  Top 0.254: R14.2 81.28,86.36 88.9,86.36 LED3.A
N$34
  Top 0.254: LED4.A 97.79,88.9 97.79,92.71 95.25,92.71 92.71,90.17 92.71,85.09 91.44,83.82 R15.2
N$35  (via drill 0.61)
  Top 0.254: LED5.A v91.44,74.93
  Bottom 0.254: R16.2 85.09,74.93 v91.44,74.93
N$36  (via drill 0.61)
  Top 0.254: R17.2 95.25,85.09 v95.25,91.44
  Bottom 0.254: v95.25,91.44 97.79,93.98 LED6.A
N$37
  Top 0.254: R18.2 102.87,90.17 102.87,102.87 110.49,110.49 113.03,110.49 113.03,102.87 LED7.A
N$38
  Top 0.254: LED8.A 110.49,107.95 110.49,91.44 100.33,81.28 100.33,66.04 99.06,64.77 R19.2
N$39
  Bottom 0.254: IC1.24 71.12,71.12 92.71,71.12 93.98,69.85 119.38,69.85 | JP15.1 119.38,69.85 | 119.38,69.85 R33.1
N$40  (via drill 0.61)
  Top 0.254: v53.34,69.85 30.48,46.99 30.48,13.97 JP8.1
  Bottom 0.254: v53.34,69.85 IC1.6
N$41  (via drill 0.61)
  Top 0.254: v27.94,46.99 24.13,43.18 JP8.2
  Bottom 0.254: IC1.11 52.07,46.99 v27.94,46.99
N$42  (via drill 0.61)
  Top 0.254: v25.4,45.72 22.86,43.18 22.86,11.43 JP8.3
  Bottom 0.254: IC1.12 53.34,45.72 v25.4,45.72
N$43  (via drill 0.61)
  Top 0.254: JP8.4 19.05,40.64 v22.86,44.45
  Bottom 0.254: IC1.13 54.61,44.45 v22.86,44.45
N$44  (via drill 0.61)
  Top 0.254: v45.72,40.64 38.1,33.02 38.1,12.7 JP9.1
  Bottom 0.254: IC1.15 60.96,40.64 v45.72,40.64
N$45  (via drill 0.61)
  Top 0.254: v41.91,41.91 36.83,36.83 36.83,13.97 JP9.2
  Bottom 0.254: IC1.16 59.69,41.91 v41.91,41.91
N$46
  Bottom 0.254: S3.1 124.46,95.25 72.39,95.25 69.85,92.71 IC1.28
N$47  (via drill 0.61)
  Top 0.254: v115.57,71.12 R34.1
  Bottom 0.254: IC1.25 72.39,72.39 115.57,72.39 | JP15.2 115.57,72.39 | 115.57,72.39 v115.57,71.12
N$48  (via drill 0.61)
  Top 0.254: JP13.1 60.96,11.43 60.96,48.26 59.69,49.53 v59.69,73.66
  Bottom 0.254: v59.69,73.66 57.15,76.2 53.34,76.2 C8.1
N$49
  Bottom 0.254: IC1.19 71.12,60.96 R21.1
N$50
  Top 0.254: LED9.A R21.2
N$51
  Top 0.254: IC4.6 IC4.7
  Bottom 0.254: IC4.6 R26.1
N$52
  Bottom 0.254: R23.2 R24.1 48.26,26.67 35.56,26.67 IC4.9
N$53
  Top 0.254: R25.2 R22.2
  Bottom 0.254: R25.2 IC4.10
N$54
  Top 0.203: DIFF.P$1 41.91,22.86 R24.2
  Bottom 0.254: R24.2 IC4.8 31.75,25.4 IC4.5
N$55
  Top 0.254: D1.C 111.76,46.99 R4.1
  Bottom 0.254: R4.1 OK1.1
N$56  (via drill 0.51)
  Top 0.203: v36.83,64.77 VOLOUT.P$1
  Top 0.254: C9.+ R26.2
  Bottom 0.254: IC1.23 68.58,68.58 40.64,68.58 v36.83,64.77 10.16,38.1 C9.+
N$57
  Top 0.254: IC3.IN C10.+ 27.94,101.6 27.94,100.33 D4.C
  Bottom 0.254: C13.1 17.78,95.25 D4.C
N$58
  Bottom 0.254: R27.2 52.07,101.6 D3.A
N$59
  Top 0.254: IC2.6 IC2.7 69.85,20.32 R8.2
N$60  (via drill 0.61)
  Top 0.254: v111.76,78.74 R35.1
  Bottom 0.254: IC1.26 71.12,78.74 v111.76,78.74 121.92,78.74 JP15.3
N$61
  Bottom 0.254: IC1.27 123.19,80.01 JP15.4 128.27,77.47 128.27,69.85 123.19,64.77 109.22,64.77 R36.1
N$62
  Top 0.254: S3.2 123.19,88.9 123.19,58.42 119.38,54.61 R37.2
N$63
  Top 0.254: IC2.13 IC2.14 78.74,39.37 78.74,44.45 77.47,45.72 68.58,45.72 67.31,44.45 67.31,26.67 66.04,25.4 R23.1
N$66
  Top 0.254: R30.2 85.09,39.37 85.09,29.21 86.36,27.94 R29.1
  Bottom 0.254: R29.1 IC2.9
N$68
  Top 0.203: BIAS.P$1 80.01,20.32 IC2.8
  Top 0.254: IC2.8 74.93,27.94 74.93,30.48 | IC2.3 74.93,30.48 | R30.1 74.93,39.37 74.93,30.48
N$71
  Top 0.203: R32.A VOLREF.P$1
  Top 0.254: IC2.12 85.09,27.94 85.09,24.13 86.36,22.86 87.63,22.86 | 87.63,22.86 92.71,22.86 R32.S R32.A | R31.1 87.63,29.21 87.63,22.86
VCC
  Top 0.203: 45.72,88.9 VOLSUPPLY.P$1
  Top 0.254: R3.2 110.49,30.48 | 110.49,30.48 R5.1 | R37.1 R36.2 109.22,58.42 | 109.22,58.42 110.49,58.42 | 110.49,58.42 R35.2 R34.2 R33.2 | V1.16 109.22,69.85 109.22,58.42 | 110.49,58.42 110.49,30.48 | 29.21,86.36 C3.2 C11.+ | 29.21,86.36 JP1.2 | R1.1 45.72,88.9 43.18,91.44 C12.1 43.18,99.06 | 43.18,99.06 IC3.OUT | 43.18,99.06 R27.1 | 29.21,30.48 R11.E | IC4.4 29.21,30.48 | 29.21,30.48 29.21,86.36 | R6.2 52.07,26.67 52.07,20.32 50.8,19.05 50.8,15.24 JP14.2
  Bottom 0.254: R6.2 57.15,31.75 71.12,31.75 IC2.4 73.66,31.75 95.25,31.75 R31.2 R3.2 | IC1.7 67.31,62.23 IC1.20 87.63,62.23 90.17,59.69 104.14,59.69 | 104.14,59.69 105.41,58.42 R36.2 | 104.14,59.69 V1.10 | C3.2 33.02,83.82 R1.1 | 16.51,13.97 20.32,17.78 R11.E | 16.51,13.97 JP12.1 | JP14.2 41.91,13.97 16.51,13.97

### Text on the board
tNames: SenseBox | Group 1 | University of Central Florida | EMI Labs
_tsilk: SenseBox | LED8 | Group 1 | ORANGE | D3 | LED7 | 1.0 K | GREEN | ORANGE | 10uF/25V | C10 | IC3 | C13 | D4 | 1N4001 | +5v 7805 | 0.1uF | S1 | S3 | LED6 | 0.1uF | C11 | C12 | LED1 | RED | LED2 | YELLOW | LED3 | GREEN | LED4 | YELLOW | LED5 | RED | ORANGE | 100/6VuF | 0.1uF | JP1 | RESET | C3 | R1 | IC1 | TL32WO | POWER OUT | 10K | ATMEGA168-PU | C8 | 150 | 150 | 150 | V1 | 0.1uF | 74595N | 150 | 150 | 150 | 150 | JP15 | Mode Selection | 22pf | 10K | 10K | 10K | 10K | 150 | C1 | 22pf | C2 | 1K | Q1 | 16Mhz | LED9 | RED | 10K | D1 | 1N4148DO35-7 | R30 | MIDI IN | JP4 | 10k | IC4 | 4N25M | 0.1uF | R2 | 220 | LM324N | C6 | IC2 | 100K | OK1 | D2 | University of Central Florida | C7 | R9 | LM324N | 3.3K | R3 | 3 | 10uF | 10k | 1N4148DO35-7 | 2 | 1M | R31 | 10uF | 4.1k | 15k | R20 | 2k | 220 | 1 | JP3 | MIDI OUT | 1K | 1K | R26 | 10k | R29 | C9 | 4.1k | 1K | 10k | R24 | R32 | PP In | R11 | R10 | 10k | JP2 | JP5 | 10k | 5k | JP7 | VOL In | VOL Out | LCD 4Bit | 10K | 10K | Program header | LCD POWER | 4 | 3 | 2 | 1 | LCD 2 pin | 4 | 3 | 2 | 1 | Program Header 2 | JP12 | JP8 | JP9 | JP14 | JP13 | EMI Labs